# EAGLE design RectifierPart (EAGLE 9.6.2)
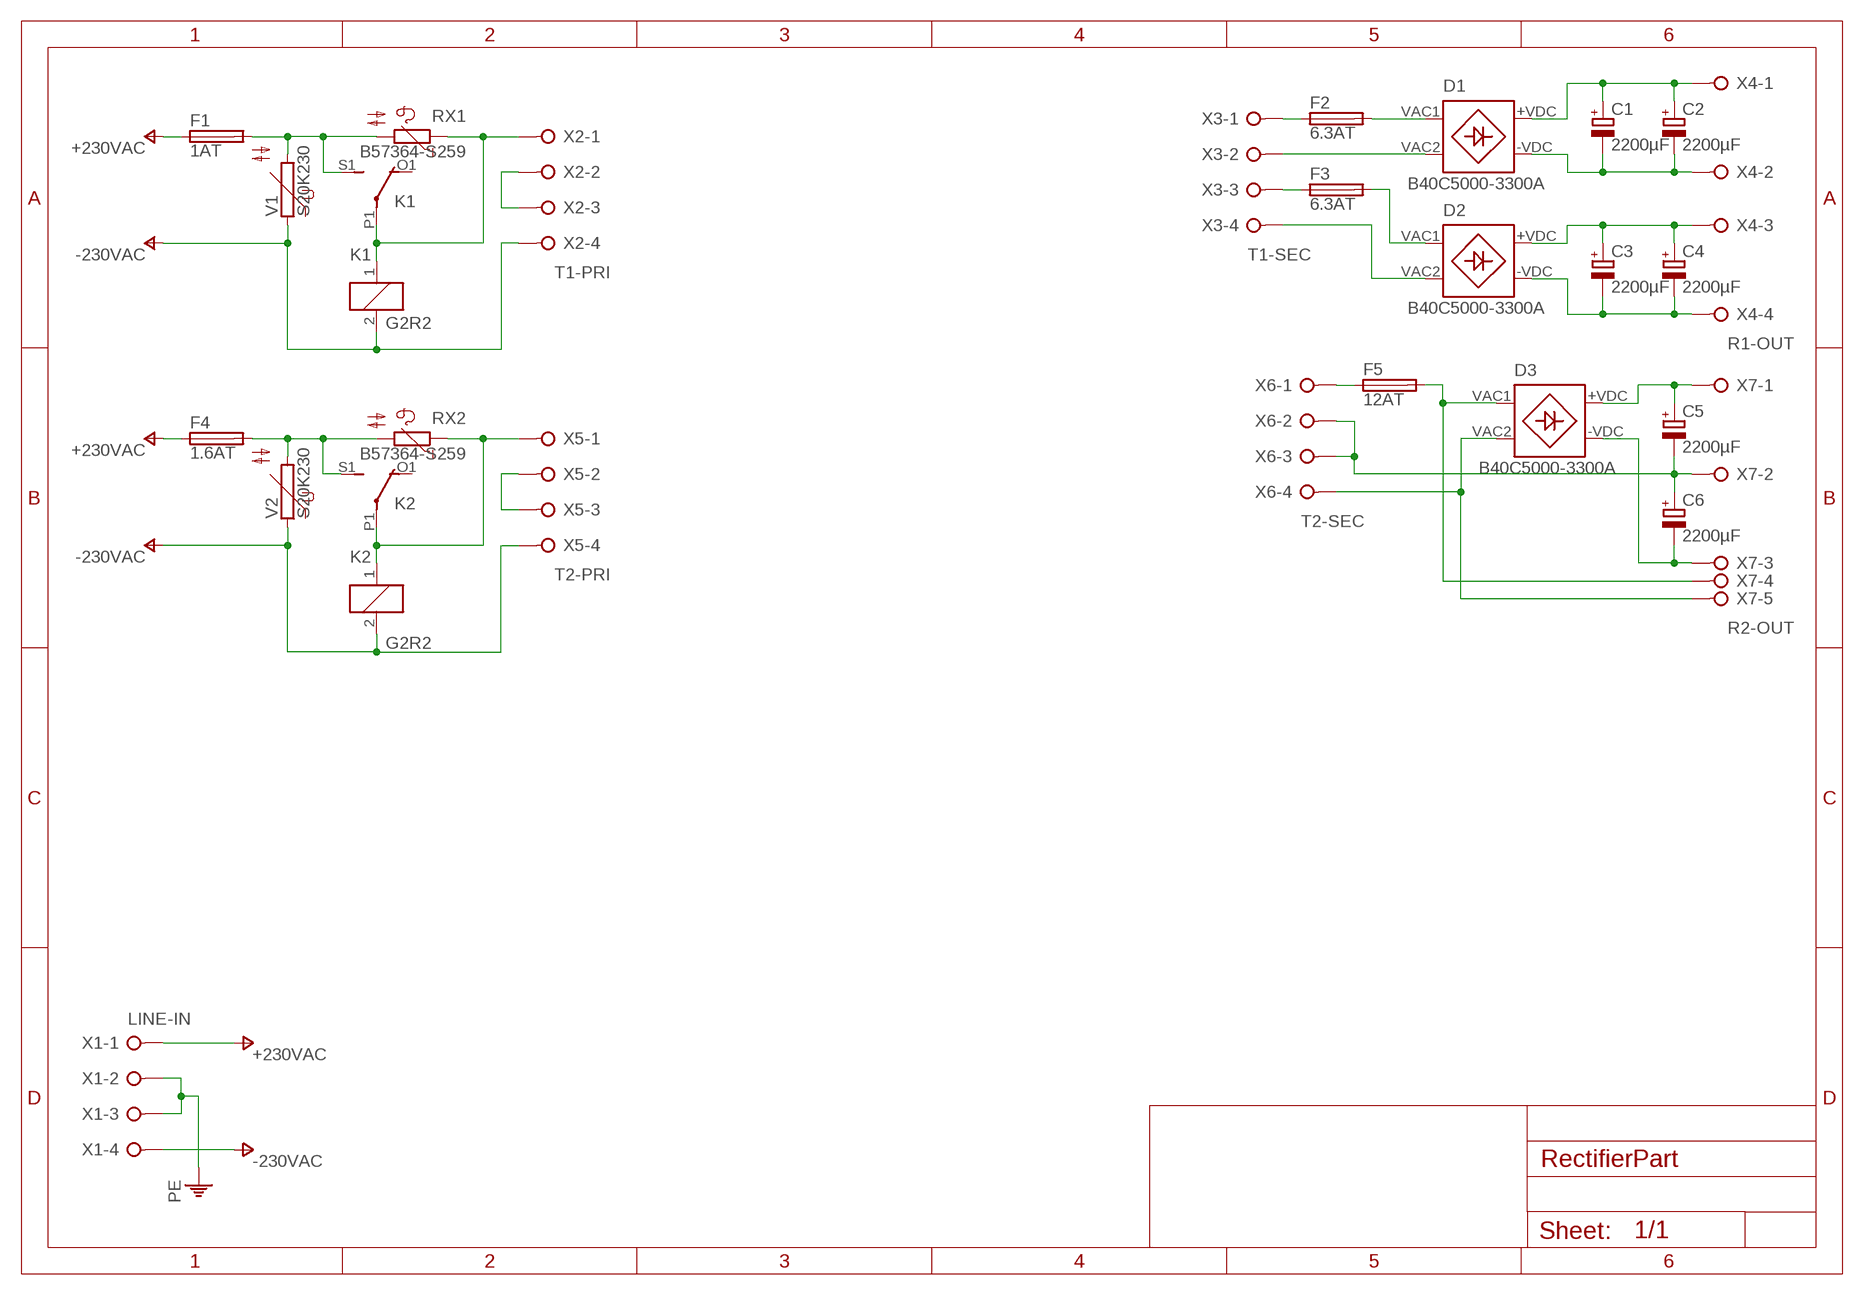
[diagram p0: schematic, sheet 1]

## Parts
C1  2200µF  CPOL-EUE7.5-16  [E7,5-16]
C2  2200µF  CPOL-EUE7.5-16  [E7,5-16]
C3  2200µF  CPOL-EUE7.5-16  [E7,5-16]
C4  2200µF  CPOL-EUE7.5-16  [E7,5-16]
C5  2200µF  CPOL-EUE7.5-16  [E7,5-16]
C6  2200µF  CPOL-EUE7.5-16  [E7,5-16]
D1  B40C5000-3300A  [B..C]
D2  B40C5000-3300A  [B..C]
D3  B40C5000-3300A  [B..C]
F1  1AT  SH22,5A  [SH22,5A]
F2  6.3AT  SH22,5A  [SH22,5A]
F3  6.3AT  SH22,5A  [SH22,5A]
F4  1.6AT  SH22,5A  [SH22,5A]
F5  12AT  SH22,5A  [SH22,5A]
K1  G2R2  [G2R2]
K2  G2R2  [G2R2]
RX1  B57364-S259  EPCB57364-S259  [B57364S0]
RX2  B57364-S259  EPCB57364-S259  [B57364S0]
V1  S20K230  [S20K230]
V2  S20K230  [S20K230]
X1  LINE-IN  W237-04P  [W237-4P]
X2  T1-PRI  W237-04P  [W237-4P]
X3  T1-SEC  W237-04P  [W237-4P]
X4  R1-OUT  W237-04P  [W237-4P]
X5  T2-PRI  W237-04P  [W237-4P]
X6  T2-SEC  W237-04P  [W237-4P]
X7  R2-OUT  W237-05P  [W237-5P]

## Nets
+230VAC: F1.1 F4.1 X1.1
-230VAC: K1.2 K2.2 V1.1 V2.1 X1.4 X2.4 X5.4
N$1: D1.VAC2 X3.2
N$2: K1.1 K1.P1(2:P) RX1.P$1 X2.1
N$3: F1.2 K1.S1(2:S) RX1.P$2 V1.2
N$4: C1.+ C2.+ D1.+VDC X4.1
N$5: X2.2 X2.3
N$6: C3.+ C4.+ D2.+VDC X4.3
N$7: C1.- C2.- D1.-VDC X4.2
N$8: F2.1 X3.1
N$9: C3.- C4.- D2.-VDC X4.4
N$10: D1.VAC1 F2.2
N$11: F4.2 K2.S1(2:S) RX2.P$2 V2.2
N$13: F3.1 X3.3
N$14: D2.VAC1 F3.2
N$15: D2.VAC2 X3.4
N$17: F5.1 X6.1
N$18: D3.VAC1 F5.2 X7.4
N$19: D3.VAC2 X6.4 X7.5
N$20: C5.+ D3.+VDC X7.1
N$21: C6.- D3.-VDC X7.3
N$22: C5.- C6.+ X6.2 X6.3 X7.2
N$23: X5.2 X5.3
N$24: K2.1 K2.P1(2:P) RX2.P$1 X5.1
PE: X1.2 X1.3
Unconnected: K1.O1(2:O) K1.O2(3:O) K1.P2(3:P) K1.S2(3:S) K2.O1(2:O) K2.O2(3:O) K2.P2(3:P) K2.S2(3:S)

## Library data of the parts
C1-C6 = rcl:CPOL-EU: POLARIZED CAPACITOR, European symbol; SPICEPREFIX: C
D1-D3 = bb84:B40C5000-3300A: Allgemeines Ausführung: Silizium-Brückengleichrichter Bauform: Standard -WW+ Modell: B40C Elektrische Werte Eingangsspannung: 40VAC Nennstrom: 5A URRM: 80V Maße Breite: 32mm Höhe: 17mm Tiefe: 5,6mm Herstellerangaben Hersteller: DIOTEC Artikelnummer des Herstellers: B40C5000-3300A Verpackungsgewicht: 0.007kg RoHS: konform EAN/GTIN: 9900002169822
F1-F5 = fuse:SH22,5A: FUSE HOLDER grid 22,5mm, isolated cap OGN0031 8201, Schurter (Buerklin); MPN: 0031.7701.11; OC_FARNELL: unknown; OC_NEWARK: 04F1224
K1 K2 = relay:G2R2: RELAY 2 x switch, Omron; MF: OMRON COMPONENTS USA; MPN: G2R-2-DC6; OC_FARNELL: unknown; OC_NEWARK: 89C5317
RX1 RX2 = bb84:EPCB57364-S259
V1 V2 = varistor:S20K230: VARISTOR
X1-X6 = con-wago-508:W237-04P: WAGO SREW CLAMP; OC_FARNELL: unknown; OC_NEWARK: unknown
X7 = con-wago-508:W237-05P: WAGO SREW CLAMP; OC_FARNELL: unknown; OC_NEWARK: unknown

## Board
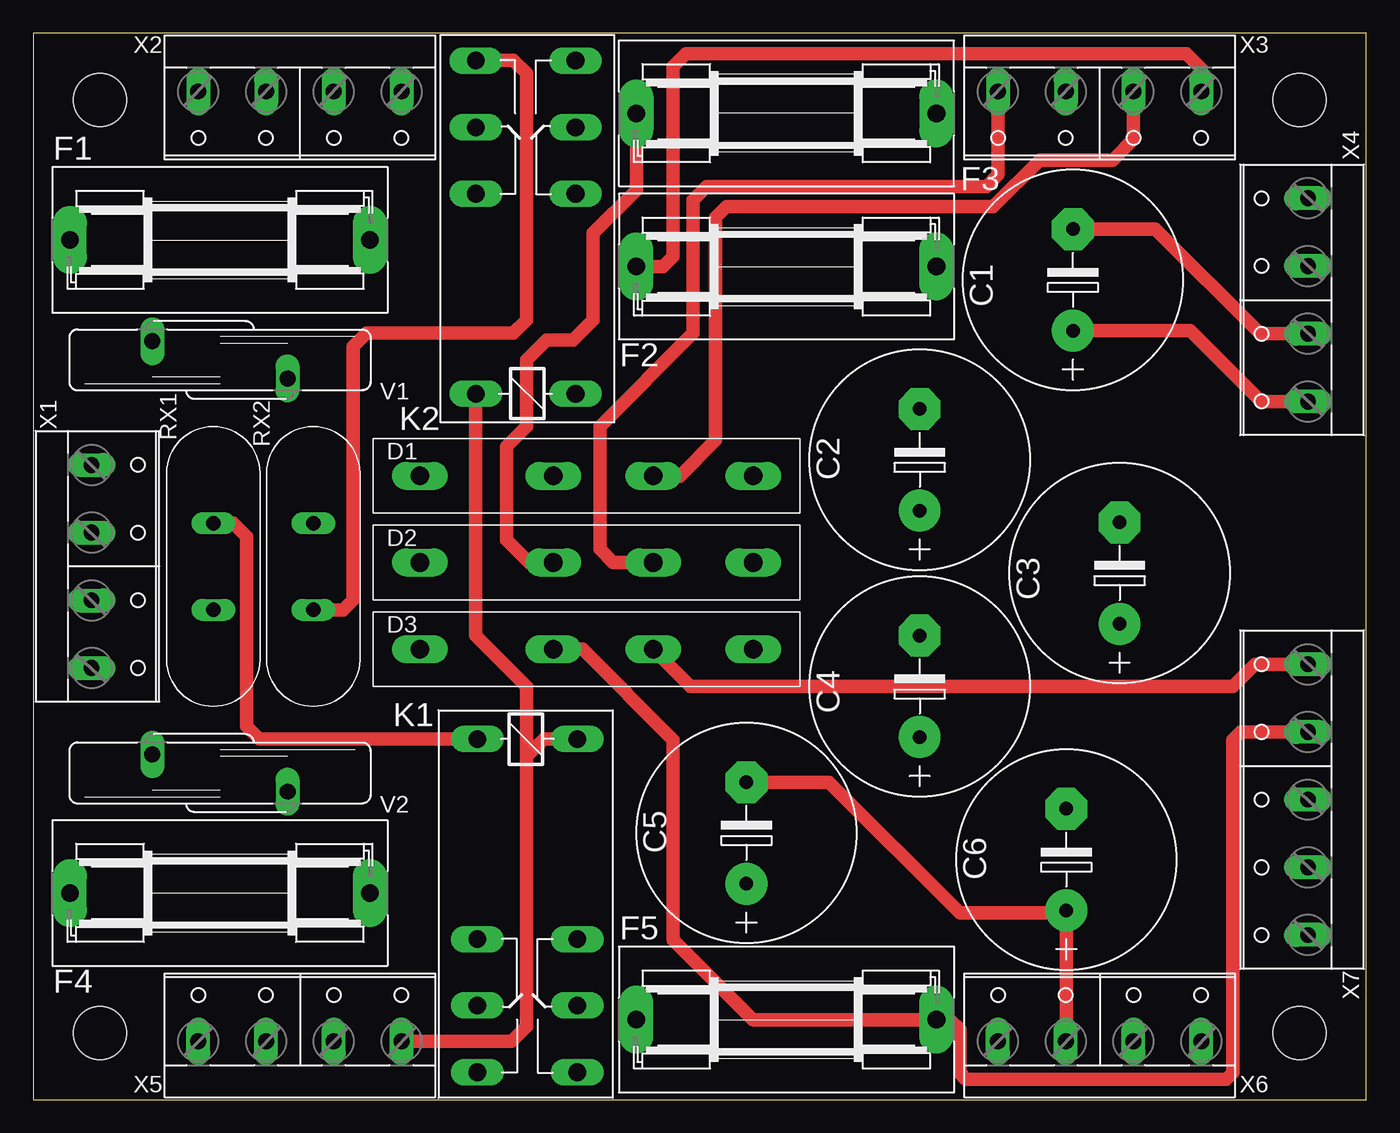
[diagram p1: board, top side]
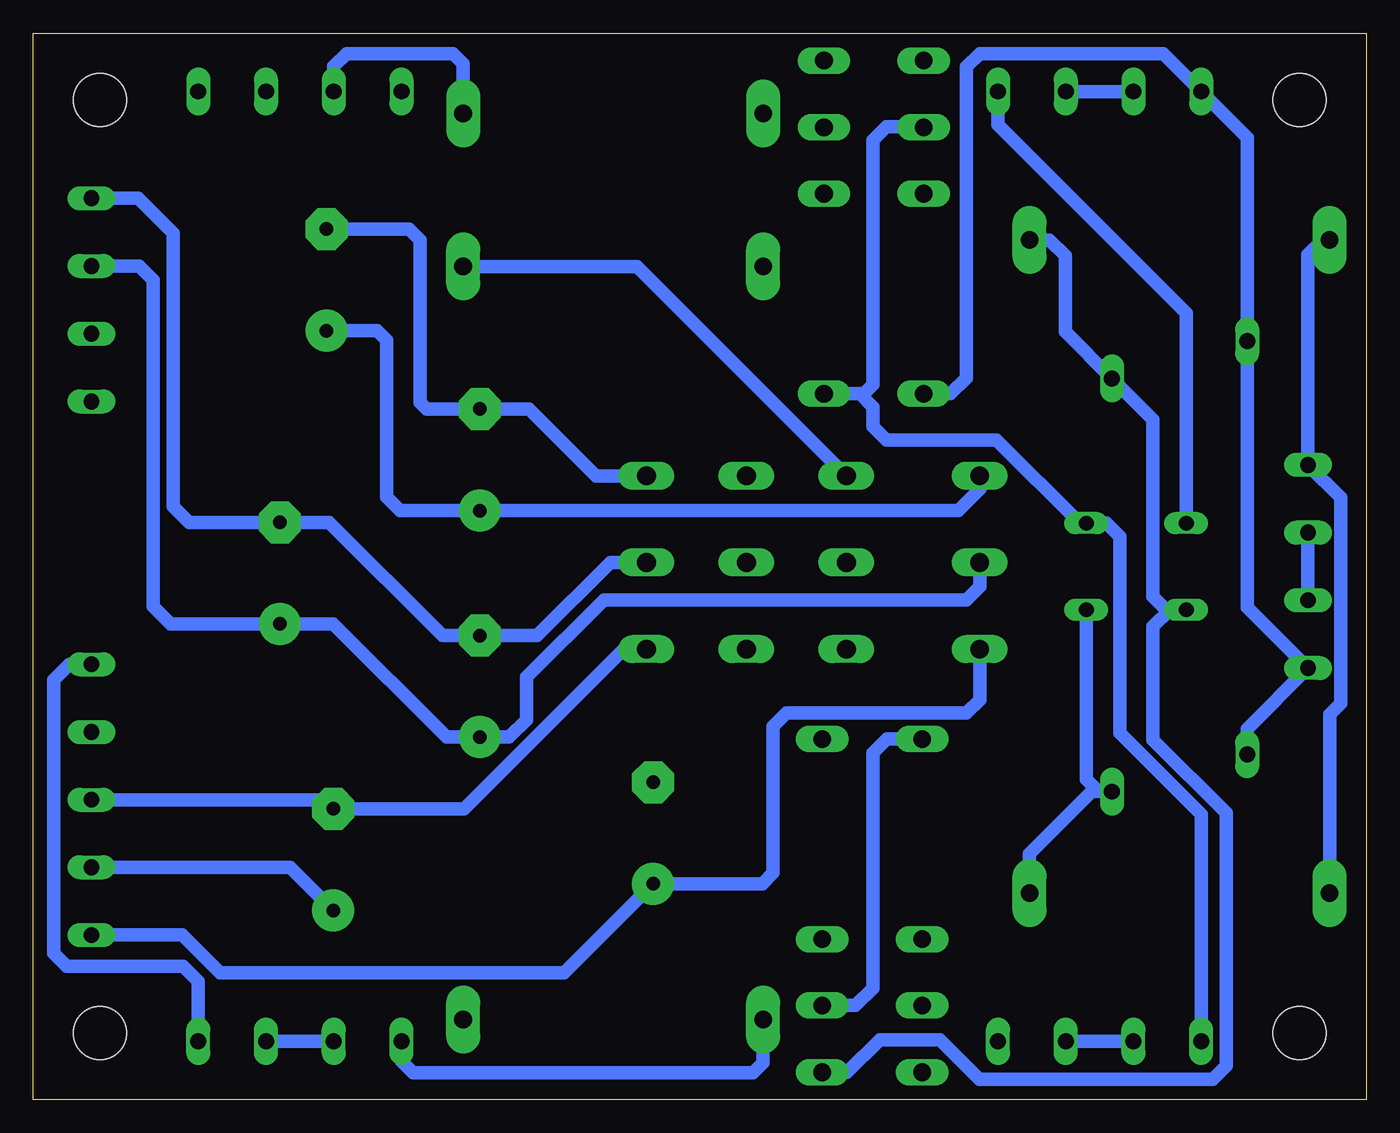
[diagram p2: board, bottom side, seen from below]

Size 100 x 80 mm. Coordinates in mm from the lower left corner, seen from the top.
Outline: 0,0 100,0 100,80 0,80 0,0
Copper layers (1*16): Top 0.035mm / dielectric 1.5mm / Bottom 0.035mm
Design rules "default *": minimum track width 40mil, minimum drill 0.35mm, track to track 6mil, track to pad 6mil, pad to pad 6mil, via to via 6mil, smd to smd 6mil, copper to edge 40mil, drill to drill 6mil, minimum pad ring 10mil, minimum via ring 8mil, stop-mask expansion 4mil, vias tented up to drill 0mil, thermal gap 10mil
Holes 4 mm at 5,5 5,75 95,75 95,5

### Footprints (pad centres in the part's own frame; a part is rotated, then mirrored left to right if it is on the bottom)
E7,5-16 = drill 1.016 pad 3.15: + -3.81,0 | drill 1.016 pad 3.15 octagon: - 3.81,0
B..C = drill 1.4 long: +VDC 3.5,2.8; -VDC 28.5,2.8; VAC1 13.5,2.8; VAC2 21,2.8
SH22,5A = drill 1.321 pad 2.54 long: 1 -11.252,0; 2 11.252,0
G2R2 = drill 1.321 long: 1 -2.54,-3.683; 2 -2.54,3.81; O1 12.471,3.81; O2 12.471,-3.683; P1 17.45,3.81; P2 17.45,-3.683; S1 22.454,3.81; S2 22.454,-3.683
B57364S0 = drill 1.1 long: P$1 -3.25,0; P$2 3.25,0
S20K230 = drill 1.194 long: 1 -1.397,-5.08; 2 1.397,5.08
W237-4P = drill 1.194 long: 1 -7.62,-0.635; 2 -2.54,-0.635; 3 2.54,-0.635; 4 7.62,-0.635
W237-5P = drill 1.194 long: 1 -10.16,-0.635; 2 -5.08,-0.635; 3 0,-0.635; 4 5.08,-0.635; 5 10.16,-0.635

### Placement (x,y rotation side)
C1  78,61.5 90 top
C2  66.5,48 90 top
C3  81.5,39.5 90 top
C4  66.5,31 90 top
C5  53.5,20 90 top
C6  77.5,18 90 top
D1  25.5,44 0 top
D2  25.5,37.5 0 top
D3  25.5,31 0 top
F1  14,64.5 0 top
F2  56.5,62.5 0 top
F3  56.5,74 180 top
F4  14,15.5 0 top
F5  56.5,6 0 top
K1  37,24.5 270 top
K2  37,55.5 90 top
RX1  13.5,40 270 top
RX2  21,40 270 top
V1  14,55.5 270 top
V2  14,24.5 270 top
X1  5,40 270 top
X2  20,75 180 top
X3  80,75 180 top
X4  95,60 90 top
X5  20,5 0 top
X6  80,5 0 top
X7  95,22.5 90 top

### Tracks (layer width: path | path; a pad name or v marks a point on that pad's centre or on a via)
+230VAC
  Bottom 1.016: F4.1 2.75,28.9 1.91,29.74 1.91,45.17 X1.1 4.37,63.38 3.25,64.5 F1.1
-230VAC
  Top 1.016: K1.2 38.31,27.04 37,25.73 | 37,25.73 37,5.5 35.87,4.37 X5.4 | 37,25.73 37,31 33.19,34.81 K2.2
  Bottom 1.016: V2.1 8.92,27.82 X1.4 8.92,36.94 V1.1 8.92,72.17 X2.4 15.22,78.48 29,78.48 30,77.48 30,54.15 31.19,52.96 K2.2
N$1
  Top 1.016: D1.VAC2 48.5,46.8 51.17,49.47 51.17,66.17 52,67 72,67 75.5,70.5 81,70.5 82.54,72.04 X3.2
N$2
  Top 1.016: RX1.P$1 15,43.25 16,42.25 16,28 16.96,27.04 K1.1
  Bottom 1.016: RX1.P$1 13.5,59.02 27.62,73.14 X2.1 | K1.P1 38.31,7.05 37,8.36 37,26 35.96,27.04 K1.1
N$3
  Bottom 1.016: F1.2 23.75,64.5 22.58,63.33 22.58,57.6 V1.2 16,51.02 16,37.75 15,36.75 RX1.P$2 14.75,36.75 16,35.5 16,27 10.5,21.5 10.5,2.52 11.5,1.52 29.02,1.52 32,4.5 36.5,4.5 38.95,2.05 K1.S1
N$4
  Top 1.016: X4.1 92.12,52.38 86.81,57.69 C1.+
  Bottom 1.016: D1.+VDC 29,45.8 30.61,44.19 C2.+ 72.5,44.19 73.5,45.19 73.5,57 74.19,57.69 C1.+
N$5
  Bottom 1.016: X2.3 X2.2
N$6
  Bottom 1.016: D2.+VDC 29,38.5 30,37.5 57.19,37.5 63,31.69 63,28.5 64.31,27.19 C4.+ 69,27.19 77.5,35.69 C3.+ 89.69,35.69 91,37 91,61.5 92.04,62.54 X4.3
N$7
  Top 1.016: X4.2 92.04,57.46 84.19,65.31 C1.-
  Bottom 1.016: D1.-VDC 57.8,46.8 62.81,51.81 C2.- 70.5,51.81 71,52.31 71,64.5 71.81,65.31 C1.-
N$8
  Top 1.016: F2.1 47.25,62.5 48,63.25 48,77.5 48.98,78.48 86.5,78.48 87.62,77.36 X3.1
N$9
  Bottom 1.016: D2.-VDC 56.7,40.3 62.19,34.81 C4.- 69.31,34.81 77.81,43.31 C3.- 88.31,43.31 89.5,44.5 89.5,65 92.12,67.62 X4.4
N$10
  Bottom 1.016: D1.VAC1 54.7,62.5 F2.2
N$11
  Top 1.016: K2.S1 33.24,78 36,78 37,77 37,58.5 36,57.5 25,57.5 24,56.5 24,37.5 23.25,36.75 RX2.P$2
  Bottom 1.016: F4.2 25.25,18.43 20.58,23.1 V2.2 20.08,23.1 21,24.02 RX2.P$2
N$13
  Bottom 1.016: F3.1 67.75,77.73 68.5,78.48 76.5,78.48 77.46,77.52 X3.3
N$14
  Top 1.016: D2.VAC1 37.2,40.3 35.5,42 35.5,49 37,50.5 37,55.5 38.5,57 40.5,57 42,58.5 42,65 45.25,68.25 F3.2
N$15
  Top 1.016: X3.4 72.38,69.38 71.5,68.5 50.5,68.5 49.5,67.5 49.5,57.5 42.5,50.5 42.5,41.3 43.5,40.3 D2.VAC2
N$17
  Bottom 1.016: F5.1 45.25,2.75 46,2 71.5,2 72.38,2.88 X6.1
N$18
  Top 1.016: D3.VAC1 41.2,33.8 48,27 48,12 54,6 F5.2 68.75,6 69.5,5.25 69.5,2 69.98,1.52 89.5,1.52 90,2.02 90,27 90.58,27.58 X7.4
N$19
  Top 1.016: D3.VAC2 49.3,31 90,31 91.66,32.66 X7.5
  Bottom 1.016: X6.4 87.62,8.87 88.75,10 97.5,10 98.48,10.98 98.48,31.5 97.32,32.66 X7.5
N$20
  Bottom 1.016: D3.+VDC 29,30 30,29 43.5,29 44.5,28 44.5,17 45.31,16.19 C5.+ 60.19,9.5 86,9.5 88.84,12.34 X7.1
N$21
  Bottom 1.016: D3.-VDC 55.7,33.8 67.69,21.81 C6.- 78.19,22.5 X7.3
N$22
  Top 1.016: X6.2 77.5,4.41 C6.+ 77.31,14 69.5,14 59.69,23.81 C5.-
  Bottom 1.016: X7.2 80.73,17.42 C6.+ | X6.2 X6.3
N$23
  Bottom 1.016: X5.2 X5.3
N$24
  Bottom 1.016: X5.1 12.38,21.38 18.5,27.5 18.5,42.25 19.5,43.25 RX2.P$1 21.5,43.25 27.75,49.5 36,49.5 37,50.5 37,51.96 38,52.96 | K2.P1 33.24,73 36,73 37,72 37,53.64 37.68,52.96 38,52.96 | 38,52.96 K2.1
PE
  Bottom 1.016: X1.3 X1.2